# Altium schematic sheet Main.SchDoc
size A3
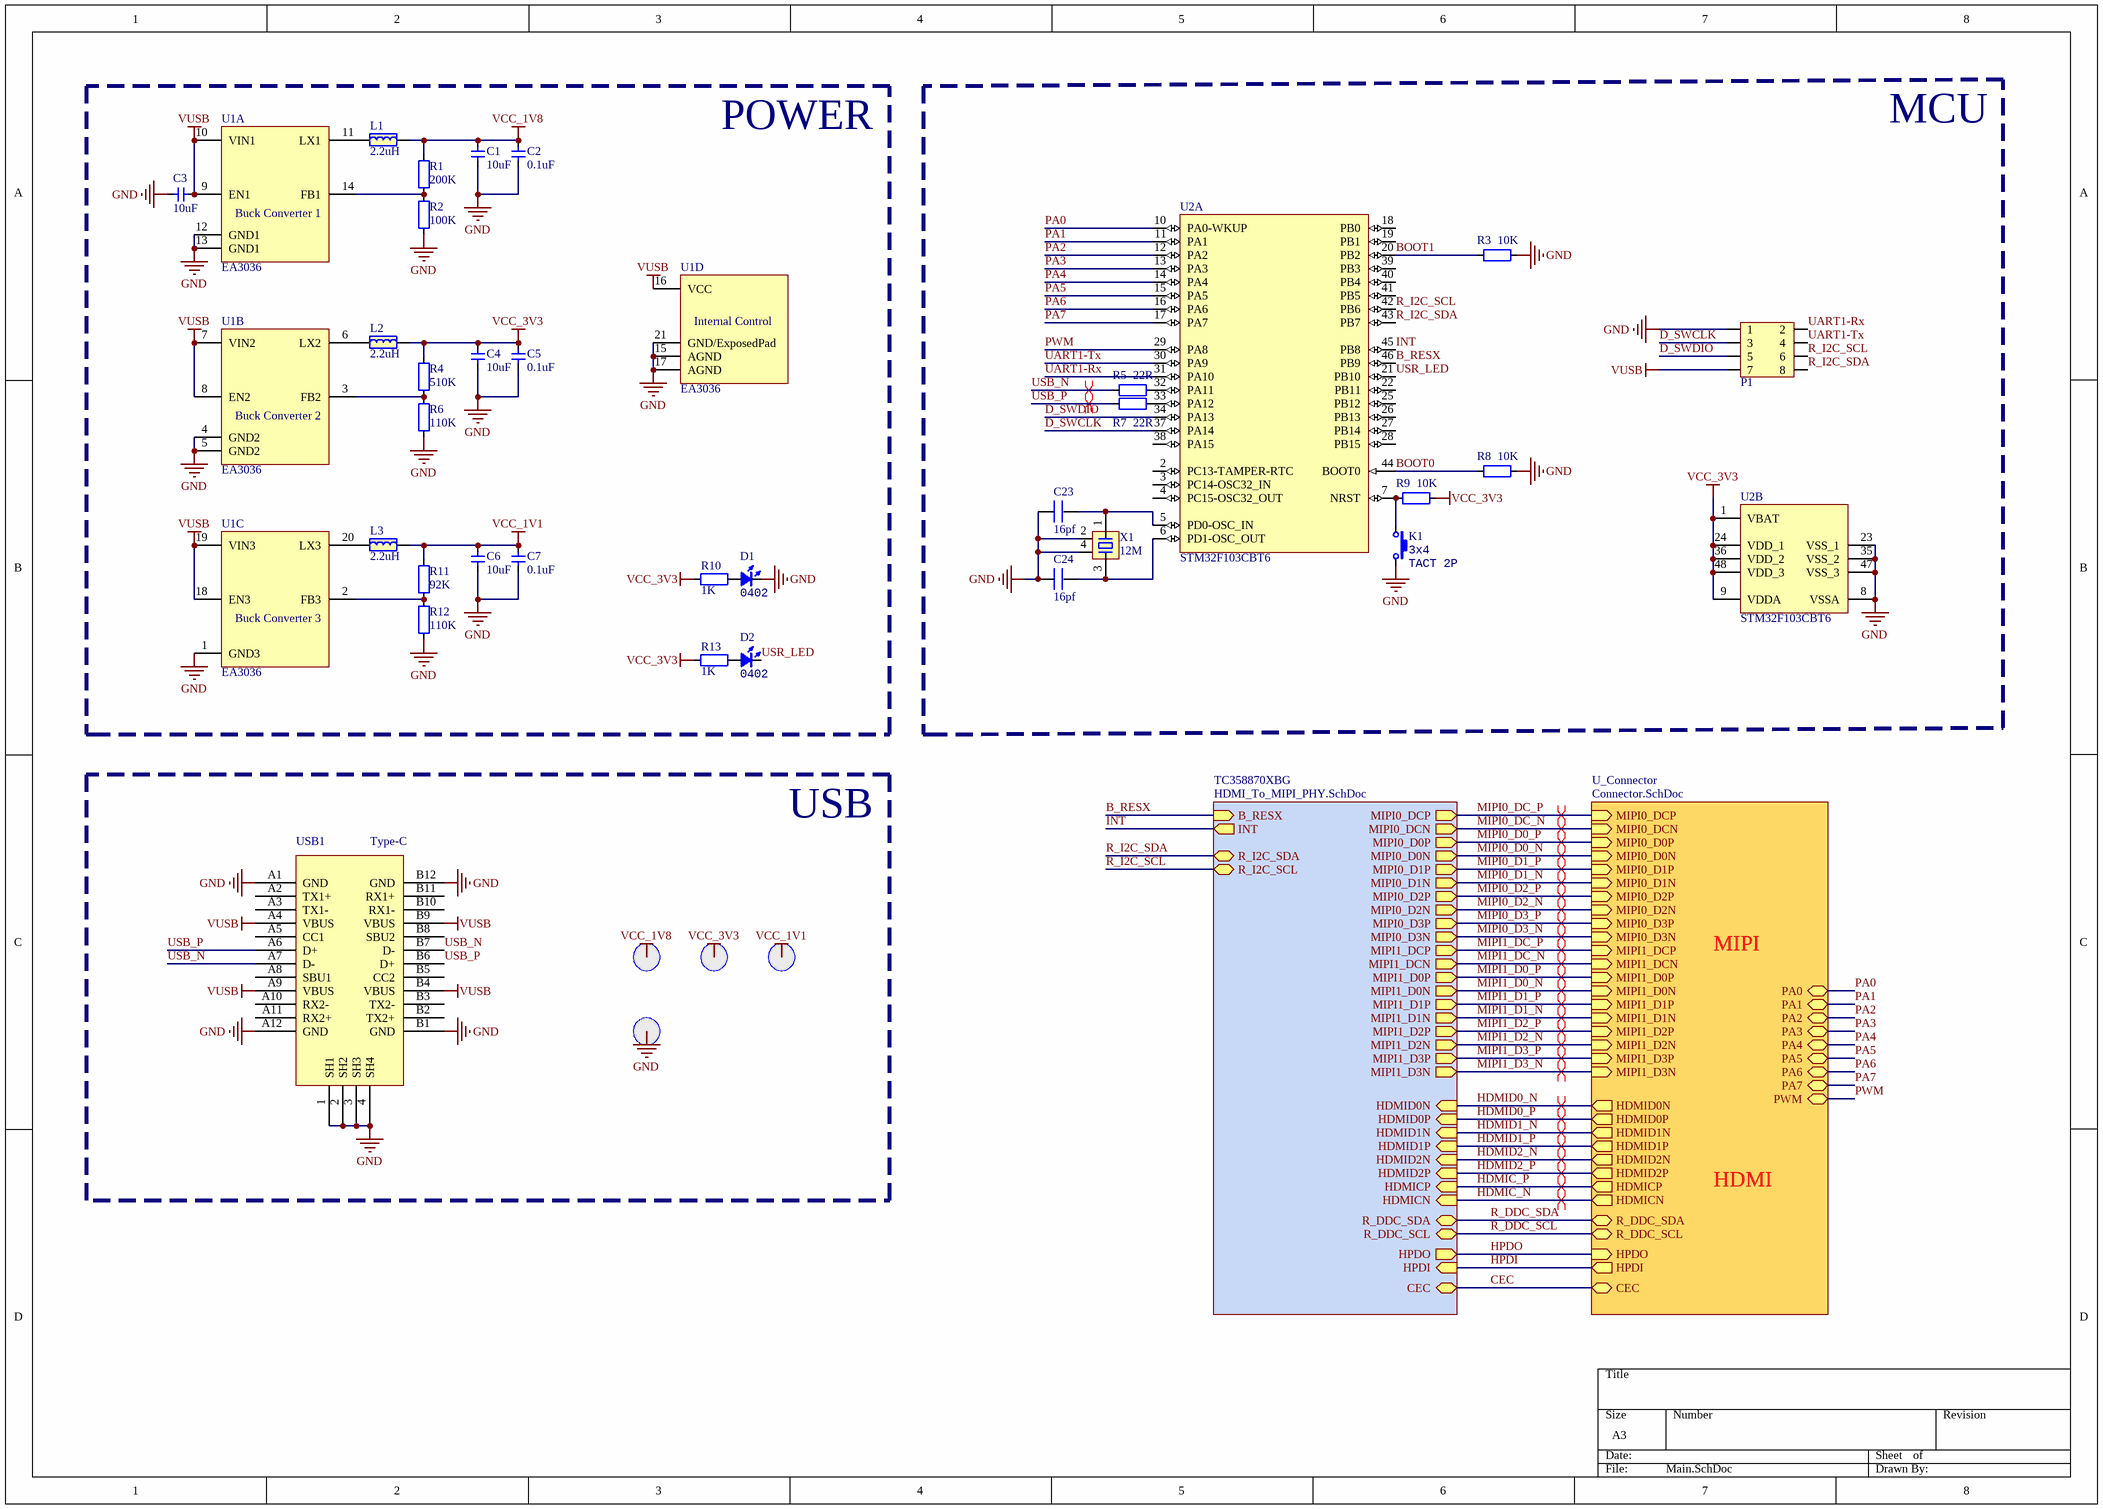
[diagram p0: Main.SchDoc]

## Parts
C1  10uF  [CAP_0402]
C2  0.1uF  [CAP_0402]
C3  10uF  [CAP_0402]
C4  10uF  [CAP_0402]
C5  0.1uF  [CAP_0402]
C6  10uF  [CAP_0402]
C7  0.1uF  [CAP_0402]
C23  16pf  [0603_CAP]
C24  16pf  [0603_CAP]
D1  Type: 0402  [SMDLED-0603]  (hidden comment: color?)
D2  Type: 0402  [SMDLED-0603]  (hidden comment: color?)
K1  value 3x4  [ButtonTACT_3x4x2_180H]  (hidden comment: TACT 2P)
L1  2.2uH  [2520-L]
L2  2.2uH  [2520-L]
L3  2.2uH  [2520-L]
P1  HDR2x4_2.54  [HDR2X4_2.54_180H]  (value not drawn)
R1  200K  [RES_0402]
R2  100K  [RES_0402]
R3  10K  [RES_0402]
R4  510K  [RES_0402]
R5  22R  [RES_0402]
R6  110K  [RES_0402]
R7  22R  [RES_0402]
R8  10K  [RES_0402]
R9  10K  [RES_0402]
R10  1K  [RES_0402]
R11  92K  [RES_0402]
R12  110K  [RES_0402]
R13  1K  [RES_0402]
T1  测试点  [TEST_PT]  (value not drawn)
T2  测试点  [TEST_PT]  (value not drawn)
T3  测试点  [TEST_PT]  (value not drawn)
T4  测试点  [TEST_PT]  (value not drawn)
U1  EA3036  [QFN-20]  (parts A,B,C,D of 4)
U2  STM32F103CBT6  [LQFP-48]  (parts A,B of 2)
USB1  Type-C  [Type-C-TOP]
X1  12M  [XTAL3225]

## Blocks framed on the sheet
POWER: C1-C7 D1 D2 L1-L3 R1 R2 R4 R6 R10-R13 U1
MCU: C23 C24 K1 P1 R3 R5 R7-R9 U2 X1

## Sub-sheets
TC358870XBG = HDMI_To_MIPI_PHY.SchDoc: B_RESX (in), INT (out), R_I2C_SDA (bidir), R_I2C_SCL (bidir), HPDI (in), HPDO (out), HDMID0N (in), HDMID0P (in), HDMID1N (in), HDMID1P (in), HDMID2N (in), HDMID2P (in), HDMICP (in), HDMICN (in), CEC (bidir), R_DDC_SDA (bidir), R_DDC_SCL (bidir), MIPI0_DCP (out), MIPI0_DCN (out), MIPI0_D0P (out), MIPI0_D0N (out), MIPI0_D1P (out), MIPI0_D1N (out), MIPI0_D2P (out), MIPI0_D2N (out), MIPI0_D3P (out), MIPI0_D3N (out), MIPI1_DCP (out), MIPI1_DCN (out), MIPI1_D0P (out), MIPI1_D0N (out), MIPI1_D1P (out), MIPI1_D1N (out), MIPI1_D2P (out), MIPI1_D2N (out), MIPI1_D3P (out), MIPI1_D3N (out)
U_Connector = Connector.SchDoc: MIPI0_DCP (in), MIPI0_DCN (in), MIPI0_D0P (in), MIPI0_D0N (in), MIPI0_D1P (in), MIPI0_D1N (in), MIPI0_D2P (in), MIPI0_D2N (in), MIPI0_D3P (in), MIPI0_D3N (in), MIPI1_DCP (in), MIPI1_DCN (in), MIPI1_D0P (in), MIPI1_D0N (in), MIPI1_D1P (in), MIPI1_D1N (in), MIPI1_D2P (in), MIPI1_D2N (in), MIPI1_D3P (in), MIPI1_D3N (in), HDMID0P (out), CEC (bidir), HDMICN (out), HDMID2P (out), HPDI (out), HPDO (in), HDMID0N (out), HDMID2N (out), HDMID1N (out), HDMID1P (out), HDMICP (out), R_DDC_SDA (bidir), R_DDC_SCL (bidir), PA5 (bidir), PWM (bidir), PA6 (bidir), PA7 (bidir), PA3 (bidir), PA4 (bidir), PA2 (bidir), PA1 (bidir), PA0 (bidir)

## Nets
GND: C1.1 C2.2 C3.1 C4.1 C5.2 C6.1 C7.2 C23.2 C24.2 D1.2(K) K1.2 P1.1 R2.1 R3.2 R6.1 R8.2 R12.1 T4.0 U1.1(GND3) U1.4(GND2) U1.5(GND2) U1.12(GND1) U1.13(GND1) U1.15(AGND) U1.17(AGND) U1.21(GND/ExposedPad) U2.8(VSSA) U2.23(VSS_1) U2.35(VSS_2) U2.47(VSS_3) USB1.1(SH1) USB1.2(SH2) USB1.3(SH3) USB1.4(SH4) USB1.A1(GND) USB1.A12(GND) USB1.B1(GND) USB1.B12(GND) X1.2 X1.4
VCC_1V1: C6.2 C7.1 L3.2 R11.2 T3.0
VCC_1V8: C1.2 C2.1 L1.2 R1.2 T1.0
VCC_3V3: C4.2 C5.1 L2.2 R4.2 R9.2 R10.1 R13.1 T2.0 U2.1(VBAT) U2.9(VDDA) U2.24(VDD_1) U2.36(VDD_2) U2.48(VDD_3)
VUSB: C3.2 P1.7 U1.7(VIN2) U1.8(EN2) U1.9(EN1) U1.10(VIN1) U1.16(VCC) U1.18(EN3) U1.19(VIN3) USB1.A4(VBUS) USB1.A9(VBUS) USB1.B4(VBUS) USB1.B9(VBUS)
B_RESX: U2.46(PB9) ; sheet TC358870XBG/B_RESX
BOOT0: R8.1 U2.44(BOOT0)
BOOT1: R3.1 U2.20(PB2)
CEC: sheet TC358870XBG/CEC, sheet U_Connector/CEC
D_SWCLK: P1.3 U2.37(PA14)
D_SWDIO: P1.5 U2.34(PA13)
HDMIC_N: sheet TC358870XBG/HDMICN, sheet U_Connector/HDMICN
HDMIC_P: sheet TC358870XBG/HDMICP, sheet U_Connector/HDMICP
HDMID0_N: sheet TC358870XBG/HDMID0N, sheet U_Connector/HDMID0N
HDMID0_P: sheet TC358870XBG/HDMID0P, sheet U_Connector/HDMID0P
HDMID1_N: sheet TC358870XBG/HDMID1N, sheet U_Connector/HDMID1N
HDMID1_P: sheet TC358870XBG/HDMID1P, sheet U_Connector/HDMID1P
HDMID2_N: sheet TC358870XBG/HDMID2N, sheet U_Connector/HDMID2N
HDMID2_P: sheet TC358870XBG/HDMID2P, sheet U_Connector/HDMID2P
HPDI: sheet TC358870XBG/HPDI, sheet U_Connector/HPDI
HPDO: sheet TC358870XBG/HPDO, sheet U_Connector/HPDO
INT: U2.45(PB8) ; sheet TC358870XBG/INT
MIPI0_D0_N: sheet TC358870XBG/MIPI0_D0N, sheet U_Connector/MIPI0_D0N
MIPI0_D0_P: sheet TC358870XBG/MIPI0_D0P, sheet U_Connector/MIPI0_D0P
MIPI0_D1_N: sheet TC358870XBG/MIPI0_D1N, sheet U_Connector/MIPI0_D1N
MIPI0_D1_P: sheet TC358870XBG/MIPI0_D1P, sheet U_Connector/MIPI0_D1P
MIPI0_D2_N: sheet TC358870XBG/MIPI0_D2N, sheet U_Connector/MIPI0_D2N
MIPI0_D2_P: sheet TC358870XBG/MIPI0_D2P, sheet U_Connector/MIPI0_D2P
MIPI0_D3_N: sheet TC358870XBG/MIPI0_D3N, sheet U_Connector/MIPI0_D3N
MIPI0_D3_P: sheet TC358870XBG/MIPI0_D3P, sheet U_Connector/MIPI0_D3P
MIPI0_DC_N: sheet TC358870XBG/MIPI0_DCN, sheet U_Connector/MIPI0_DCN
MIPI0_DC_P: sheet TC358870XBG/MIPI0_DCP, sheet U_Connector/MIPI0_DCP
MIPI1_D0_N: sheet TC358870XBG/MIPI1_D0N, sheet U_Connector/MIPI1_D0N
MIPI1_D0_P: sheet TC358870XBG/MIPI1_D0P, sheet U_Connector/MIPI1_D0P
MIPI1_D1_N: sheet TC358870XBG/MIPI1_D1N, sheet U_Connector/MIPI1_D1N
MIPI1_D1_P: sheet TC358870XBG/MIPI1_D1P, sheet U_Connector/MIPI1_D1P
MIPI1_D2_N: sheet TC358870XBG/MIPI1_D2N, sheet U_Connector/MIPI1_D2N
MIPI1_D2_P: sheet TC358870XBG/MIPI1_D2P, sheet U_Connector/MIPI1_D2P
MIPI1_D3_N: sheet TC358870XBG/MIPI1_D3N, sheet U_Connector/MIPI1_D3N
MIPI1_D3_P: sheet TC358870XBG/MIPI1_D3P, sheet U_Connector/MIPI1_D3P
MIPI1_DC_N: sheet TC358870XBG/MIPI1_DCN, sheet U_Connector/MIPI1_DCN
MIPI1_DC_P: sheet TC358870XBG/MIPI1_DCP, sheet U_Connector/MIPI1_DCP
PA0: U2.10(PA0-WKUP) ; sheet U_Connector/PA0
PA1: U2.11(PA1) ; sheet U_Connector/PA1
PA2: U2.12(PA2) ; sheet U_Connector/PA2
PA3: U2.13(PA3) ; sheet U_Connector/PA3
PA4: U2.14(PA4) ; sheet U_Connector/PA4
PA5: U2.15(PA5) ; sheet U_Connector/PA5
PA6: U2.16(PA6) ; sheet U_Connector/PA6
PA7: U2.17(PA7) ; sheet U_Connector/PA7
PWM: U2.29(PA8) ; sheet U_Connector/PWM
R_DDC_SCL: sheet TC358870XBG/R_DDC_SCL, sheet U_Connector/R_DDC_SCL
R_DDC_SDA: sheet TC358870XBG/R_DDC_SDA, sheet U_Connector/R_DDC_SDA
R_I2C_SCL: P1.6 U2.42(PB6) ; sheet TC358870XBG/R_I2C_SCL
R_I2C_SDA: P1.8 U2.43(PB7) ; sheet TC358870XBG/R_I2C_SDA
UART1-Rx: P1.2 U2.31(PA10)
UART1-Tx: P1.4 U2.30(PA9)
USB_N: R5.1 USB1.A7(D-) USB1.B7(D-)
USB_P: R7.1 USB1.A6(D+) USB1.B6(D+)
USR_LED: D2.2(K) U2.21(PB10)
NetC23_1: C23.1 U2.5(PD0-OSC_IN) X1.1
NetC24_1: C24.1 U2.6(PD1-OSC_OUT) X1.3
NetD1_1: D1.1(A) R10.2
NetD2_1: D2.1(A) R13.2
NetK1_1: K1.1 R9.1 U2.7(NRST)
NetL1_1: L1.1 U1.11(LX1)
NetL2_1: L2.1 U1.6(LX2)
NetL3_1: L3.1 U1.20(LX3)
NetR1_1: R1.1 R2.2 U1.14(FB1)
NetR4_1: R4.1 R6.2 U1.3(FB2)
NetR5_2: R5.2 U2.32(PA11)
NetR7_2: R7.2 U2.33(PA12)
NetR11_1: R11.1 R12.2 U1.2(FB3)

Not connected (* = marked no-connect by the designer): U2 2(PC13-TAMPER-RTC) 3(PC14-OSC32_IN) 4(PC15-OSC32_OUT) 18(PB0) 19(PB1) 22(PB11) 25(PB12) 26(PB13) 27(PB14) 28(PB15) 38(PA15) 39(PB3) 40(PB4) 41(PB5); USB1 A2(TX1+) A3(TX1-) A5(CC1) A8(SBU1) A10(RX2-) A11(RX2+) B2(TX2+) B3(TX2-) B5(CC2) B8(SBU2) B10(RX1-) B11(RX1+)

## Layout directives
differential pair: HDMIC_N, HDMIC_P, HDMID0_N, HDMID0_P, HDMID1_N, HDMID1_P, HDMID2_N, HDMID2_P, MIPI0_D0_N, MIPI0_D0_P, MIPI0_D1_N, MIPI0_D1_P, MIPI0_D2_N, MIPI0_D2_P, MIPI0_D3_N, MIPI0_D3_P, MIPI0_DC_N, MIPI0_DC_P, MIPI1_D0_N, MIPI1_D0_P, MIPI1_D1_N, MIPI1_D1_P, MIPI1_D2_N, MIPI1_D2_P, MIPI1_D3_N, MIPI1_D3_P, MIPI1_DC_N, MIPI1_DC_P, USB_N, USB_P

## Notes on the sheet
- USB
- MIPI
- HDMI
- (in symbol EA3036, part A) Buck Converter 1
- (in symbol EA3036, part B) Buck Converter 2
- (in symbol EA3036, part C) Buck Converter 3
- (in symbol EA3036, part D) Internal Control

## Library data of the parts
C1-C7 = 电容-0402: Capacitor; Value: 0.1u
C23 C24 = C
D1 D2 = LED_0402: LED; Value: color?
K1 = ButtonTACT_3x4x2_180: Button; type: TACT 2P
L1-L3 = 电感-2520: 磁珠
P1 = HDR2x4_2.54: Header
R1-R4 R6 R8-R13 = 电阻-0402: Resistor; Value: 22R
R5 R7 = 电阻-0402: Resistor; Value: 22R
U1 = EA3036: EA3036 is a 3CH power management IC for applications powered by one Li-Ion battery or a DC 5V adapter.
U2 = STM32F103CBT6: ARM Cortex-M3 32-bit MCU, 128 KB Flash, 20 KB Internal RAM, 37 I/Os, 48-pin LQFP, -40 to 85 degC, Tray; A/D Converter: 2x12-bit (10 Channel); FLASH Size (Prog) (kB): 128; I/Os (High Current): 37; Internal RAM Size (kB): 20; Operating Frequency(F) (Processor speed) (MHz): 72; Supply Voltage(Vcc) min (V): 2; DatasheetVersion: Rev. 16; PackageVersion: Rev. 6, 06/2013; PackageReference: LQFP48; PackageDescription: 48-Pin Low Profile Quad Flat Package, 7 x 7 mm Body, 0.5 mm Pitch; Supplier 1: Digi-Key; Supplier Part Number 1: 497-6288-ND; Supplier 2: Farnell; Supplier Part Number 2: 1606327; Core: ARM Cortex-M3; Packing: Tray; Mounting Technology: Surface Mount; PartNumber: STM32F103CBT6; ComponentLink1Description: Manufacturer URL; ComponentLink1URL: http://www.st.com/web/en/home.html; ComponentLink2Description: Datasheet; ComponentLink2URL: http://www.st.com/st-web-ui/static/active/en/resource/technical/document/datasheet/CD00161566.pdf; ComponentLink3Description: Package Specification; ComponentLink3URL: http://www.st.com/st-web-ui/static/active/en/resource/technical/document/datasheet/DM00058181.pdf; Supplier 3: Newark; Supplier Part Number 3: 11N8296; Supplier 4: Newark; Supplier Part Number 4: 57P1214; Supplier 5: Mouser; Supplier Part Number 5: 511-STM32F103CBT6
USB1 = USB-Type-C-TOP
X1 = XTAL-4P: 4脚无源晶振; 版权归属: 源创客; BOM名称: 4脚无源晶振; 学习资源: www.ooocke.com